# Altium schematic sheet low-pass-filter.SchDoc
size A4; SheetNumber: 4; SheetTotal: 8
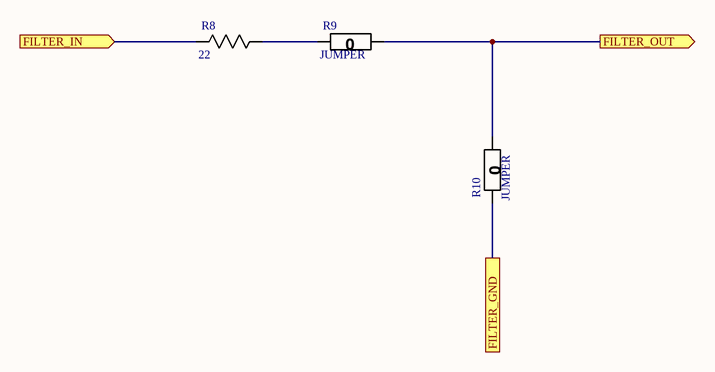
[diagram p0: low-pass-filter.SchDoc]

## Parts
R8  22  [0805]
R9  JUMPER  [0805]
R10  JUMPER  [0805]

## Ports
FILTER_GND, FILTER_IN (in), FILTER_OUT (out)

## Nets
FILTER_GND: R10.2(R2) ; port FILTER_GND
FILTER_IN: R8.2(R2) ; port FILTER_IN
FILTER_OUT: R9.1(R1) R10.1(R1) ; port FILTER_OUT
NetR8_1: R8.1(R1) R9.2(R2)

## Library data of the parts
R8 = RES 22.0 1/8W: RES SMD 22 OHM 5% 1/8W 0805; Power (Watts): 0.125W; Package: 0805; Value: 22; Tolerance: 5%
R9 R10 = RES 0 JUMPER: RES SMD 0 OHM JUMPER GENERIC 0805/0603; Value: 0; Package: 0805